# Altium project 程控放大器.PrjPcb
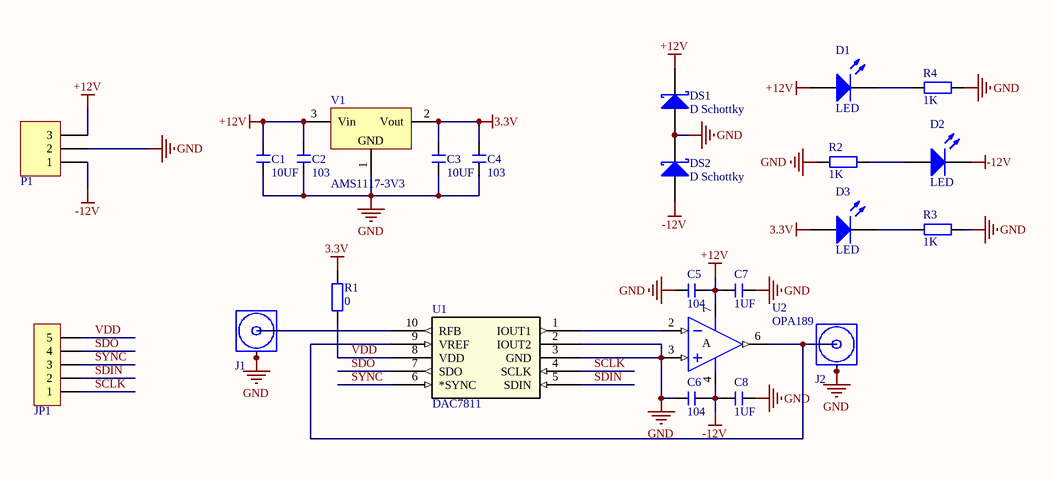
[diagram p0: 程控放大器.SchDoc]
1 sheet, 24 parts. Net scope: global (net labels, ports and power ports of the same name join across sheets).
Board file: 程控放大器.PcbDoc

## Sheet 程控放大器.SchDoc
size A4

### Parts
C1  10UF  [C 0805]
C2  103  [C 0603]
C3  10UF  [C 0805]
C4  103  [C 0603]
C5  104  [C 0805]
C6  104  [C 0805]
C7  1UF  [C 0805]
C8  1UF  [C 0805]
D1  LED  [LED_0805]
D2  LED  [LED_0805]
D3  LED  [LED_0805]
DS1  D Schottky  [DIODE-SMA]
DS2  D Schottky  [DIODE-SMA]
J1  COAX  [MCX5.08-5-H]  (value not drawn)
J2  COAX  [MCX5.08-5-H]  (value not drawn)
JP1  HDR-1X5  [HDR-1X5]  (value not drawn)
P1  Header 3  [HDR3X1_B2]  (value not drawn)
R1  0  [R 0603]
R2  1K  [R 0805]
R3  1K  [R 0805]
R4  1K  [R 0805]
U1  DAC7811  [VSSOP 10 (DGK)]
U2  OPA189  [SOIC8_N]
V1  AMS1117-3V3  [SOT223_L]

### Nets
3.3V: C3.1 C4.1 D3.1(A) R1.2 V1.2(Vout)
+12V: C1.1 C2.1 C5.2 C7.1 D1.1(A) DS1.2 P1.3 U2.7(V+) V1.3(Vin)
-12V: C6.2 C8.1 D2.2(K) DS2.1 P1.1 U2.4(V-)
GND: C1.2 C2.2 C3.2 C4.2 C5.1 C6.1 C7.2 C8.2 DS1.1 DS2.2 J1.2(GND) J1.3(GND) J1.4(GND) J1.5(GND) J2.2(GND) J2.3(GND) J2.4(GND) J2.5(GND) P1.2 R2.1 R3.2 R4.2 U1.2(IOUT2) U1.3(GND) U2.3(+IN) V1.1(GND)
SCLK: JP1.1 U1.4(SCLK)
SDIN: JP1.2 U1.5(SDIN)
SDO: JP1.4 U1.7(SDO)
SYNC: JP1.3 U1.6(*SYNC)
VDD: JP1.5 R1.1 U1.8(VDD)
NetD1_2: D1.2(K) R4.1
NetD2_1: D2.1(A) R2.2
NetD3_2: D3.2(K) R3.1
NetJ1_1: J1.1(Signal) U1.10(RFB)
NetJ2_1: J2.1(Signal) U1.9(VREF) U2.6(OUT)
NetU1_1: U1.1(IOUT1) U2.2(-IN)

### Notes on the sheet
- (in symbol OPA189) A

### Library data of the parts
C1-C8 = C: 无极性贴片电容; 版权归属: 源创客; BOM名称: 无极性贴片电容; 学习资源: www.ooocke.com
D1-D3 = LED: 发光二极管; Published: 8-Jun-2000; LatestRevisionDate: 08-Jul-2005; LatestRevisionNote: Mech Layer 1 removed.; PackageReference: LED; Publisher: Altium Limited
DS1 DS2 = D Schottky: Schottky Diode; Published: 8-Jun-2000; LatestRevisionDate: 17-Jul-2002; LatestRevisionNote: Re-released for DXP Platform.; PackageReference: SMB; Publisher: Altium Limited; PackageDescription: DO-214-AA/SMB; 2 C-Bend Leads; Body 5.3 x 3.6 mm, inc. leads (LxW); Code_JEDEC: DO-214-AA
JP1 = Header 5: 5P接插件; 版权归属: 源创客; BOM名称: 5P接插件; 学习资源: www.ooocke.com
P1 = Header 3: 接插件; LatestRevisionDate: 17-Jul-2002; LatestRevisionNote: Re-released for DXP Platform.; Publisher: Altium Limited
R1-R4 = R: 贴片电阻; 版权归属: 源创客; BOM名称: 贴片电阻; 学习资源: www.ooocke.com
U1 = DAC7811: 12-Bit, Serial Input, Multiplying Digital-to-Analog Converter; Manufacturer: Texas Instruments; Manufacturer_Part_Number: dac7811_dgs_10; INDUSTRY_STD_PKG_TYPE: MSOP; FAMILY_NAME: PRECISION DAC (=<10MSPS); PIN_COUNT: 10; PACKAGE_DESIGNATOR: DGS; Datasheet URL: http://www.ti.com/lit/gpn/DAC7811; GENERIC_PART_NUMBER: DAC7811; Vendor: Texas Instruments; RefDes: RefDes; Type: DEV; Value: Value
U2 = OPA189: 支持多路复用器的 14MHz、低噪声、零漂移、RRO、CMOS 精密运算放大器 /
V1 = AMS1117: 三端稳压芯片; BOM名称: 稳压芯片; 版权归属: 源创客; 学习资源: www.ooocke.com